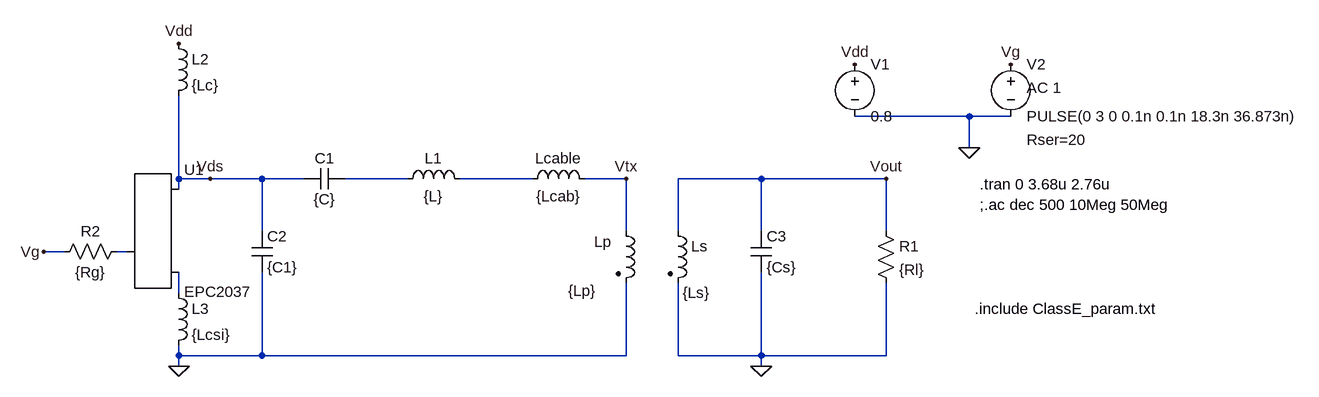
[diagram p0: schematic ClassE_v2.asc]
ClassE_v2.asc, the LTspice schematic file:
Version 4
SHEET 1 1432 680
WIRE 352 -48 176 -48
WIRE 416 -48 352 -48
WIRE 352 0 352 -48
WIRE -864 48 -864 -80
WIRE -816 48 -864 48
WIRE -736 48 -816 48
WIRE -672 48 -736 48
WIRE -512 48 -608 48
WIRE -320 48 -432 48
WIRE -176 48 -240 48
WIRE 32 48 -96 48
WIRE 224 48 32 48
WIRE -864 64 -864 48
WIRE -736 128 -736 48
WIRE -176 128 -176 48
WIRE -96 128 -96 48
WIRE 32 128 32 48
WIRE 224 128 224 48
WIRE -1040 160 -1072 160
WIRE -944 160 -960 160
WIRE -864 224 -864 192
WIRE -864 320 -864 304
WIRE -736 320 -736 192
WIRE -736 320 -864 320
WIRE -176 320 -176 208
WIRE -176 320 -736 320
WIRE -96 320 -96 208
WIRE 32 320 32 192
WIRE 32 320 -96 320
WIRE 224 320 224 208
WIRE 224 320 32 320
WIRE -864 336 -864 320
WIRE 32 336 32 320
FLAG 352 0 0
FLAG 416 -128 Vg
FLAG -864 -160 Vdd
FLAG -1072 160 Vg
FLAG -176 48 Vtx
FLAG -864 336 0
FLAG 32 336 0
FLAG 224 48 Vout
FLAG -816 48 Vds
FLAG 176 -128 Vdd
SYMBOL voltage 416 -144 R0
WINDOW 123 24 52 Left 2
WINDOW 39 24 132 Left 2
SYMATTR Value2 AC 1
SYMATTR SpiceLine Rser=20
SYMATTR InstName V2
SYMATTR Value PULSE(0 3 0 0.1n 0.1n 18.3n 36.873n)
SYMBOL EPCGaN -944 160 R0
SYMATTR InstName U1
SYMATTR Value EPC2037
SYMBOL ind -880 -176 R0
SYMATTR InstName L2
SYMATTR Value {Lc}
SYMATTR SpiceLine Rser=0.1
SYMBOL ind -528 64 R270
WINDOW 0 32 56 VTop 2
WINDOW 3 5 56 VBottom 2
SYMATTR InstName L1
SYMATTR Value {L}
SYMATTR SpiceLine Rser=0.1
SYMBOL cap -608 32 R90
WINDOW 0 0 32 VBottom 2
WINDOW 3 32 32 VTop 2
SYMATTR InstName C1
SYMATTR Value {C}
SYMATTR SpiceLine Rser=0.1
SYMBOL res 208 112 R0
SYMATTR InstName R1
SYMATTR Value {Rl}
SYMBOL cap -752 128 R0
SYMATTR InstName C2
SYMATTR Value {C1}
SYMATTR SpiceLine Rser=0.1
SYMBOL res -944 144 R90
WINDOW 0 0 56 VBottom 2
WINDOW 3 32 56 VTop 2
SYMATTR InstName R2
SYMATTR Value {Rg}
SYMBOL ind2 -192 112 R0
WINDOW 0 -33 33 Left 2
WINDOW 3 -73 108 Left 2
SYMATTR InstName Lp
SYMATTR Value {Lp}
SYMATTR Type ind
SYMATTR SpiceLine Rser={Rp}
SYMBOL ind2 -112 112 R0
WINDOW 3 23 111 Left 2
SYMATTR Value {Ls}
SYMATTR InstName Ls
SYMATTR Type ind
SYMATTR SpiceLine Rser={Rs}
SYMBOL cap 16 128 R0
SYMATTR InstName C3
SYMATTR Value {Cs}
SYMBOL ind -880 208 R0
SYMATTR InstName L3
SYMATTR Value {Lcsi}
SYMATTR SpiceLine Rser=0.1
SYMBOL voltage 176 -144 R0
WINDOW 123 0 0 Left 0
WINDOW 39 0 0 Left 0
SYMATTR InstName V1
SYMATTR Value 0.8
SYMBOL ind -336 64 R270
WINDOW 0 32 56 VTop 2
WINDOW 3 5 56 VBottom 2
SYMATTR InstName Lcable
SYMATTR Value {Lcab}
SYMATTR SpiceLine Rser={Rcab}
TEXT 360 248 Left 2 !.include ClassE_param.txt
TEXT 368 56 Left 2 !.tran 0 3.68u 2.76u
TEXT 368 88 Left 2 !;.ac dec 500 10Meg 50Meg

The netlist it stands for:
* ClassE_v2.asc
V2 Vg 0 PULSE(0 3 0 0.1n 0.1n 18.3n 36.873n) AC 1 Rser=20
XU1 N003 Vds N004 EPC2037
L2 Vdd Vds {Lc} Rser=0.1
L1 N001 N002 {L} Rser=0.1
C1 N001 Vds {C} Rser=0.1
R1 Vout 0 {Rl}
C2 Vds 0 {C1} Rser=0.1
R2 N003 Vg {Rg}
Lp Vtx 0 {Lp} Rser={Rp}
Ls Vout 0 {Ls} Rser={Rs}
C3 Vout 0 {Cs}
L3 N004 0 {Lcsi} Rser=0.1
V1 Vdd 0 0.8
Lcable N002 Vtx {Lcab} Rser={Rcab}
.include ClassE_param.txt
.tran 0 3.68u 2.76u
;.ac dec 500 10Meg 50Meg
.backanno
.end